# Altium schematic sheet MM32_BLDC.SchDoc
size A4; SheetNumber: 1; SheetTotal: 1
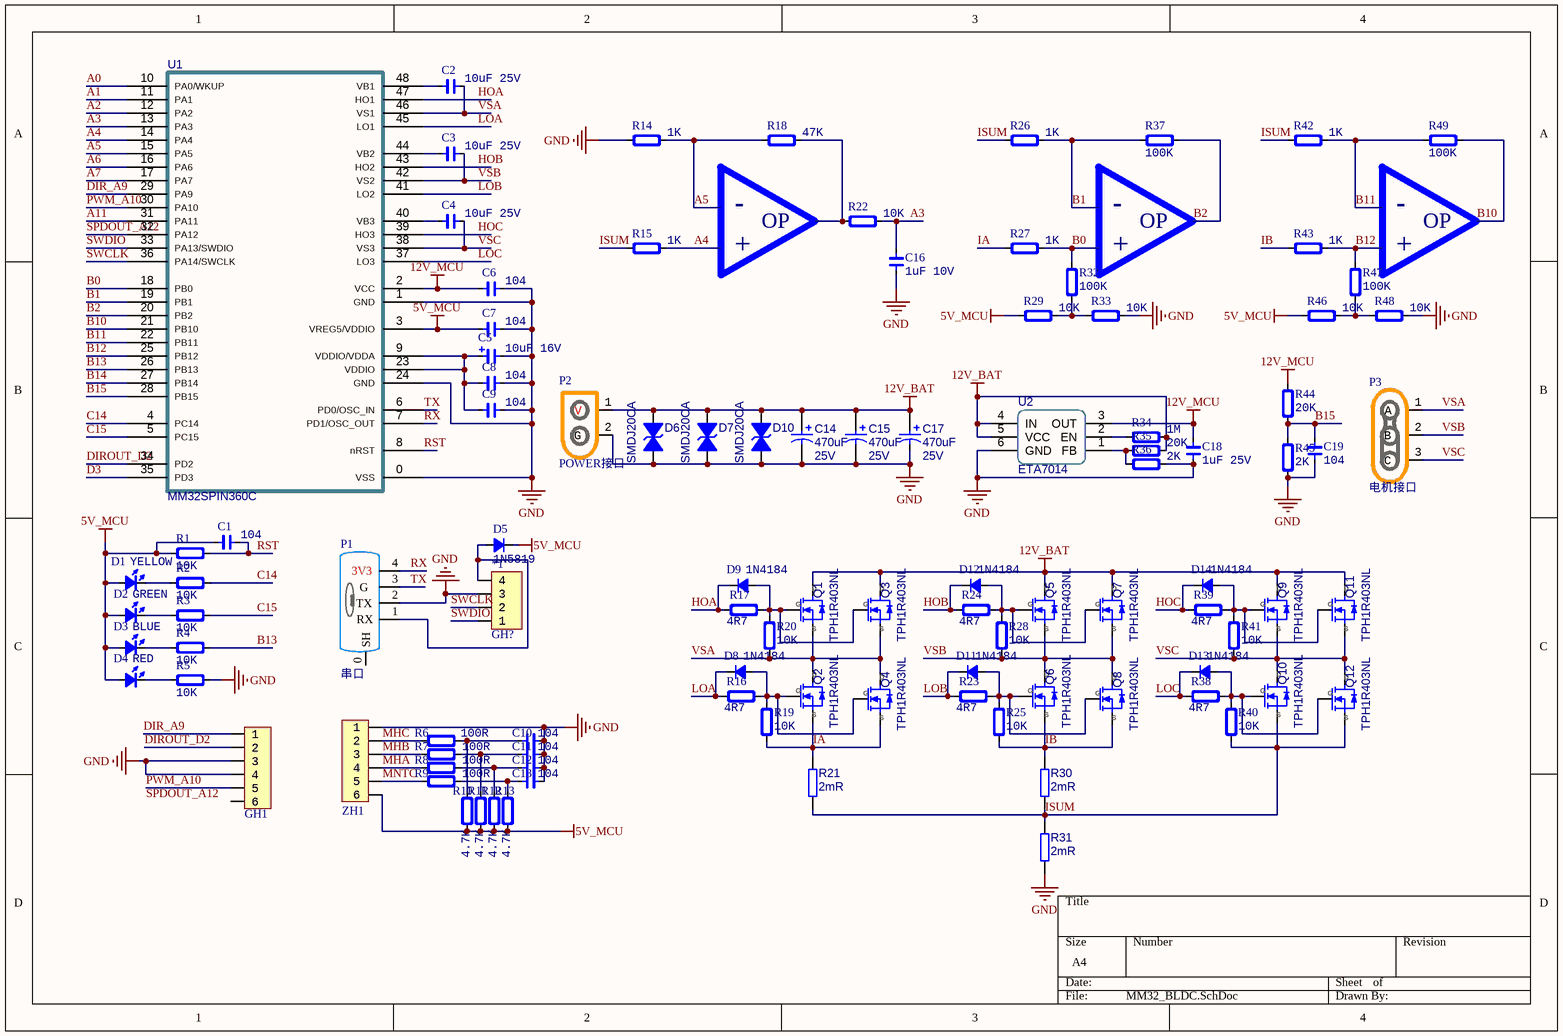
[diagram p0: MM32_BLDC.SchDoc]

## Parts
*1  GH?  [MX 1.25-LS-4P]
C1  104  [CAP_0603]
C2  10uF 25V  [CAP_0603]
C3  10uF 25V  [CAP_0603]
C4  10uF 25V  [CAP_0603]
C5  10uF 16V  [CAP_TAN_A1206]
C6  104  [CAP_0603]
C7  104  [CAP_0603]
C8  104  [CAP_0603]
C9  104  [CAP_0603]
C10  104  [CAP_0603]
C11  104  [CAP_0603]
C12  104  [CAP_0603]
C13  104  [CAP_0603]
C14  value 470uF  Voltage: 25V  [CAPPR3.5-8X12]  (hidden comment: 470uF 25V)
C15  value 470uF  Voltage: 25V  [CAPPR3.5-8X12]  (hidden comment: 470uF 25V)
C16  1uF 10V  [CAP_0603]
C17  value 470uF  Voltage: 25V  [CAPPR3.5-8X12]  (hidden comment: 470uF 25V)
C18  1uF 25V  [CAP_0603]
C19  104  [CAP_0603]
D1  YELLOW  [LED_0603_RED]
D2  GREEN  [LED_0603_RED]
D3  BLUE  [LED_0603_RED]
D4  RED  [LED_0603_RED]
D5  1N5819  [SOD-123]
D6  SMDJ20CA  [SMC[DO-214AB]]
D7  SMDJ20CA  [SMC[DO-214AB]]
D8  1N4184  [SOD-323]
D9  1N4184  [SOD-323]
D10  SMDJ20CA  [SMC[DO-214AB]]
D11  1N4184  [SOD-323]
D12  1N4184  [SOD-323]
D13  1N4184  [SOD-323]
D14  1N4184  [SOD-323]
GH1  HDR1x6  [MX 1.25-WS-4P]  (value not drawn)
P1  串口  [GH1.25-LS-4P]
P2  POWER接口  [XT30UPB-M]
P3  电机接口  [AMASS-MR30-M]
Q1  TPH1R403NL  [DFN5x6]
Q2  TPH1R403NL  [DFN5x6]
Q3  TPH1R403NL  [DFN5x6]
Q4  TPH1R403NL  [DFN5x6]
Q5  TPH1R403NL  [DFN5x6]
Q6  TPH1R403NL  [DFN5x6]
Q7  TPH1R403NL  [DFN5x6]
Q8  TPH1R403NL  [DFN5x6]
Q9  TPH1R403NL  [DFN5x6]
Q10  TPH1R403NL  [DFN5x6]
Q11  TPH1R403NL  [DFN5x6]
Q12  TPH1R403NL  [DFN5x6]
R1  10K  [RES_0603]
R2  10K  [RES_0603]
R3  10K  [RES_0603]
R4  10K  [RES_0603]
R5  10K  [RES_0603]
R6  100R  [RES_0603]
R7  100R  [RES_0603]
R8  100R  [RES_0603]
R9  100R  [RES_0603]
R10  4.7K  [RES_0603]
R11  4.7K  [RES_0603]
R12  4.7K  [RES_0603]
R13  4.7K  [RES_0603]
R14  1K  [RES_0603]
R15  1K  [RES_0603]
R16  4R7  [RES_0603]
R17  4R7  [RES_0603]
R18  47K  [RES_0603]
R19  10K  [RES_0603]
R20  10K  [RES_0603]
R21  value 2mR  [RESC6332[2512]S]  (hidden comment: 2mR ±1%)
R22  10K  [RES_0603]
R23  4R7  [RES_0603]
R24  4R7  [RES_0603]
R25  10K  [RES_0603]
R26  1K  [RES_0603]
R27  1K  [RES_0603]
R28  10K  [RES_0603]
R29  10K  [RES_0603]
R30  value 2mR  [RESC6332[2512]S]  (hidden comment: 2mR ±1%)
R31  value 2mR  [RESC6332[2512]S]  (hidden comment: 2mR ±1%)
R32  100K  [RES_0603]
R33  10K  [RES_0603]
R34  1M  [RES_0603]
R35  20K  [RES_0603]
R36  2K  [RES_0603]
R37  100K  [RES_0603]
R38  4R7  [RES_0603]
R39  4R7  [RES_0603]
R40  10K  [RES_0603]
R41  10K  [RES_0603]
R42  1K  [RES_0603]
R43  1K  [RES_0603]
R44  20K  [RES_0603]
R45  2K  [RES_0603]
R46  10K  [RES_0603]
R47  100K  [RES_0603]
R48  10K  [RES_0603]
R49  100K  [RES_0603]
U1  MM32SPIN360C  [QFN48-6x6]
U2  ETA7014  [SOT-23-6]
ZH1  MX1.25_6P  [ZH1.5-WF-6P]  (value not drawn)

## Nets
5V_MCU: C1.1 C7.1 D1.1(A) D2.1(A) D3.1(A) D4.1(A) D5.2(K) R1.1 R10.2 R11.2 R12.2 R13.2 R29.2 R46.2 U1.3(VREG5/VDDIO) ZH1.6
12V_BAT: C14.1 C15.1 C17.1 D6.K D7.K D10.K P2.1(V) Q1.1(D) Q3.1(D) Q5.1(D) Q7.1(D) Q9.1(D) Q11.1(D) R34.1 R35.1 U2.4(IN) U2.5(VCC)
12V_MCU: C6.1 C18.2 R44.1 U1.2(VCC) U2.3(OUT)
GND: *1.3 C5.2 C6.2 C7.2 C8.2 C9.2 C10.1 C11.1 C12.1 C13.1 C14.2 C15.2 C16.1 C17.2 C18.1 C19.1 D6.A D7.A D10.A GH1.3 GH1.4 P1.2(TX) P2.2(G) R5.2 R14.2 R31.1 R33.1 R36.1 R45.2 R48.1 U1.0(VSS) U1.1(GND) U1.24(GND) U2.6(GND) ZH1.1
A0: U1.10(PA0/WKUP)
A1: U1.11(PA1)
A2: U1.12(PA2)
A3: C16.2 R22.1 U1.13(PA3)
A4: R15.1 U1.14(PA4)
A5: R14.1 R18.2 U1.15(PA5)
A6: U1.16(PA6)
A7: U1.17(PA7)
A11: U1.31(PA11)
B0: R27.1 R32.1 U1.18(PB0)
B1: R26.1 R37.1 U1.19(PB1)
B2: R37.2 U1.20(PB2)
B10: R49.2 U1.21(PB10)
B11: R42.1 R49.1 U1.22(PB11)
B12: R43.1 R47.1 U1.25(PB12)
B13: R4.2 U1.26(PB13)
B14: U1.27(PB14)
B15: C19.2 R44.2 R45.1 U1.28(PB15)
C14: R2.2 U1.4(PC14)
C15: R3.2 U1.5(PC15)
D3: U1.35(PD3)
DIR_A9: GH1.1 U1.29(PA9)
DIROUT_D2: GH1.2 U1.34(PD2)
HOA: D9.2(K) R17.2 U1.47(HO1)
HOB: D12.2(K) R24.2 U1.43(HO2)
HOC: D14.2(K) R39.2 U1.39(HO3)
IA: Q2.3(S) Q4.3(S) R19.2 R21.2 R27.2
IB: Q6.3(S) Q8.3(S) R25.2 R30.2 R43.2
ISUM: Q10.3(S) Q12.3(S) R15.2 R21.1 R26.2 R30.1 R31.2 R40.2 R42.2
LOA: D8.2(K) R16.2 U1.45(LO1)
LOB: D11.2(K) R23.2 U1.41(LO2)
LOC: D13.2(K) R38.2 U1.37(LO3)
MHA: R8.1 ZH1.4
MHB: R7.1 ZH1.3
MHC: R6.1 ZH1.2
MNTC: R9.1 ZH1.5
PWM_A10: GH1.5 U1.30(PA10)
RST: C1.2 R1.2 U1.8(nRST)
RX: P1.4(3V3) U1.7(PD1/OSC_OUT)
SPDOUT_A12: U1.32(PA12)
SWCLK: *1.2 U1.36(PA14/SWCLK)
SWDIO: *1.1 U1.33(PA13/SWDIO)
TX: P1.3(G) U1.6(PD0/OSC_IN)
VSA: C2.2 P3.1(A) Q1.3(S) Q2.1(D) Q3.3(S) Q4.1(D) R20.2 U1.46(VS1)
VSB: C3.2 P3.2(B) Q5.3(S) Q6.1(D) Q7.3(S) Q8.1(D) R28.2 U1.42(VS2)
VSC: C4.2 P3.3(C) Q9.3(S) Q10.1(D) Q11.3(S) Q12.1(D) R41.2 U1.38(VS3)
Net*1_4: *1.4 D5.1(A) P1.1(RX)
NetC2_1: C2.1 U1.48(VB1)
NetC3_1: C3.1 U1.44(VB2)
NetC4_1: C4.1 U1.40(VB3)
NetC5_1: C5.1 C8.1 C9.1 U1.9(VDDIO/VDDA) U1.23(VDDIO)
NetC10_2: C10.2 R6.2 R10.1
NetC11_2: C11.2 R7.2 R11.1
NetC12_2: C12.2 R8.2 R12.1
NetC13_2: C13.2 R9.2 R13.1
NetD1_2: D1.2(K) R2.1
NetD2_2: D2.2(K) R3.1
NetD3_2: D3.2(K) R4.1
NetD4_2: D4.2(K) R5.1
NetD8_1: D8.1(A) Q2.2(G) Q4.2(G) R16.1 R19.1
NetD9_1: D9.1(A) Q1.2(G) Q3.2(G) R17.1 R20.1
NetD11_1: D11.1(A) Q6.2(G) Q8.2(G) R23.1 R25.1
NetD12_1: D12.1(A) Q5.2(G) Q7.2(G) R24.1 R28.1
NetD13_1: D13.1(A) Q10.2(G) Q12.2(G) R38.1 R40.1
NetD14_1: D14.1(A) Q9.2(G) Q11.2(G) R39.1 R41.1
NetR18_1: R18.1 R22.2
NetR29_1: R29.1 R32.2 R33.2
NetR34_2: R34.2 U2.2(EN)
NetR35_2: R35.2 R36.2 U2.1(FB)
NetR46_1: R46.1 R47.2 R48.2

Not connected (* = marked no-connect by the designer): GH1 6; P1 0(SH); ZH1 0

## Notes on the sheet
- -
- OP
- +
- Labels drawn without touching a wire or pin: SPDOUT_A12

## Library data of the parts
*1 = 4P接口: MX
C1-C4 C6-C13 C16 C18 C19 = Cap_0603: Capacitor; Specification: X7R, ±10%, 16V; Manufacturer: *
C5 = Cap_Tan_1206: Capacitor Tantalum; Specification: X7R, ±10%, 16V; Note: ±10%; Type: 1206; Manufacturer: *; Value: 10uF 16V
C14 C15 C17 = Cap-Elect: Polarized Capacitor (Radial); Published: 8-Jun-2000; Revision: July-2002: Re-released for DXP Platform.; Publisher: Altium Limited; Price(RMB): 0.000
D1-D4 = LED_0603: LED; Type: 0603; Manufacturer: *; Specification: *; Note: *
  D1: Value: YELLOW
  D2: Value: GREEN
  D3: Value: BLUE
  D4: Value: RED
D5 = Diode_SOD123: Diode; Type: SOD123; Manufacturer: *; Specification: *; Note: *; Value: 1N5819
D6 D7 D10 = Diode TVS Bi-Dir: TRANSIENT VOLTAGE  SUPPRESSOR DIODE; Imax: 500mA; Published: 8-Jun-2000; Publisher: Altium Limited; Price(RMB): 0.000
D8 D9 D11-D14 = Diode_SOD323: Diode; Type: SOD323; Manufacturer: *; Specification: *; Note: *; Value: 1N4184
GH1 = HDR1x6_2.54: Header
P1 = 串口: MX
P2 = POWER接口: POWER
Q1-Q12 = TPH1R403NL: 东芝 N沟 MOS
R1-R20 R22-R29 R32-R49 = Res_0603: Resistor; Specification: ±1%; Manufacturer: *; Note: ±1%; Type: 0603
  R1-R5 R19 R20 R22 R25 R28 R29 R33 R40 R41 R46 R48: Value: 10K
  R6-R9: Value: 100R
  R10-R13: Value: 4.7K
  R14 R15 R26 R27 R42 R43: Value: 1K
  R16 R17 R23 R24 R38 R39: Value: 4R7
  R18: Value: 47K
  R32 R37 R47 R49: Value: 100K
  R34: Value: 1M
  R35 R44: Value: 20K
  R36 R45: Value: 2K
R21 R30 R31 = Res-Chip_11: 贴片电阻; Published: 8-Jun-2000; Revision: July-2002: Re-released for DXP Platform.; Tolerance: ±1%
U2 = ETA7014: ETA7014 OVP芯片
ZH1 = MX1.25_6P: MX
U1 = MM32SPIN360C: Published: 30-May-2008; DatasheetVersion: rev6, Mar-2008; PackageVersion: Mar-2008; PackageReference: LQFP48; Publisher: Altium Limited; PackageDescription: 48-Pin Low-Profile Quad Flat Pack, 7 x 7 mm Body, 0.5 mm Pitch (LQFP48); ComponentLink1Description: Manufacturer Link; ComponentLink1URL: www.st.com/stm32; ComponentLink2Description: Datasheet; ComponentLink2URL: http://www.st.com/stonline/products/literature/ds/13587.pdf